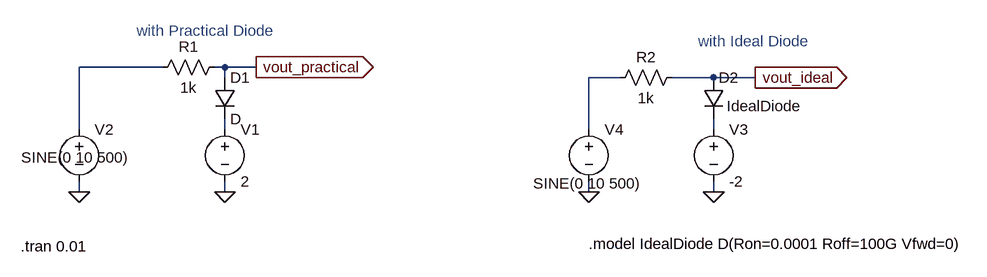
[diagram p0: schematic 1.asc]
1.asc, the LTspice schematic file:
Version 4
SHEET 1 1244 680
WIRE -48 -64 -176 -64
WIRE 48 -64 32 -64
WIRE 96 -64 48 -64
WIRE 48 -48 48 -64
WIRE 656 -48 608 -48
WIRE 800 -48 736 -48
WIRE 864 -48 800 -48
WIRE -176 32 -176 -64
WIRE 48 32 48 16
WIRE 608 32 608 -48
WIRE 800 32 800 16
WIRE -176 128 -176 112
WIRE 48 128 48 112
WIRE 608 128 608 112
WIRE 800 128 800 112
FLAG -176 128 0
FLAG 48 128 0
FLAG 608 128 0
FLAG 800 128 0
FLAG 96 -64 vout_practical
IOPIN 96 -64 Out
FLAG 864 -48 vout_ideal
IOPIN 864 -48 Out
SYMBOL voltage 48 16 R0
WINDOW 123 0 0 Left 0
WINDOW 39 0 0 Left 0
SYMATTR InstName V1
SYMATTR Value 2
SYMBOL voltage -176 16 R0
WINDOW 3 -89 59 Left 2
WINDOW 123 0 0 Left 0
WINDOW 39 0 0 Left 0
SYMATTR InstName V2
SYMATTR Value SINE(0 10 500)
SYMBOL res 48 -80 R90
WINDOW 0 0 56 VBottom 2
WINDOW 3 32 56 VTop 2
SYMATTR InstName R1
SYMATTR Value 1k
SYMBOL res 752 -64 R90
WINDOW 0 0 56 VBottom 2
WINDOW 3 32 56 VTop 2
SYMATTR InstName R2
SYMATTR Value 1k
SYMBOL diode 32 -48 R0
SYMATTR InstName D1
SYMBOL diode 784 -48 R0
WINDOW 3 36 44 Left 2
SYMATTR InstName D2
SYMATTR Value IdealDiode
SYMBOL voltage 800 16 R0
WINDOW 123 0 0 Left 0
WINDOW 39 0 0 Left 0
SYMATTR InstName V3
SYMATTR Value -2
SYMBOL voltage 608 16 R0
WINDOW 3 -86 99 Left 2
WINDOW 123 0 0 Left 0
WINDOW 39 0 0 Left 0
SYMATTR InstName V4
SYMATTR Value SINE(0 10 500)
TEXT 608 208 Left 2 !.model IdealDiode D(Ron=0.0001 Roff=100G Vfwd=0)
TEXT -266 212 Left 2 !.tran 0.01
TEXT -88 -120 Left 2 ;with Practical Diode
TEXT 776 -104 Left 2 ;with Ideal Diode

The netlist it stands for:
* 1.asc
V1 N003 0 2
V2 N001 0 SINE(0 10 500)
R1 vout_practical N001 1k
R2 vout_ideal N002 1k
D1 vout_practical N003 D
D2 vout_ideal N004 IdealDiode
V3 N004 0 -2
V4 N002 0 SINE(0 10 500)
.model D D
.lib standard.dio
.model IdealDiode D(Ron=0.0001 Roff=100G Vfwd=0)
.tran 0.01
* with Practical Diode
* with Ideal Diode
.backanno
.end